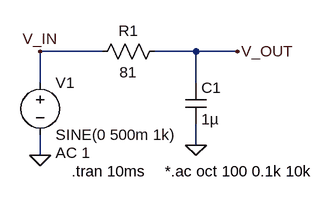
[diagram p0: schematic low_pass_filter.asc]
low_pass_filter.asc, the LTspice schematic file:
Version 4
SHEET 1 880 680
WIRE 144 112 48 112
WIRE 288 112 224 112
WIRE 352 112 288 112
WIRE 48 160 48 112
WIRE 288 160 288 112
WIRE 288 256 288 224
WIRE 48 272 48 240
FLAG 48 272 0
FLAG 288 256 0
FLAG 352 112 V_OUT
FLAG 48 112 V_IN
SYMBOL res 240 96 R90
WINDOW 0 0 56 VBottom 2
WINDOW 3 32 56 VTop 2
SYMATTR InstName R1
SYMATTR Value 81
SYMBOL cap 272 160 R0
SYMATTR InstName C1
SYMATTR Value 1µ
SYMBOL voltage 48 144 R0
WINDOW 123 24 124 Left 2
WINDOW 39 0 0 Left 0
SYMATTR InstName V1
SYMATTR Value SINE(0 500m 1k)
SYMATTR Value2 AC 1
TEXT 240 296 Left 2 !*.ac oct 100 0.1k 10k
TEXT 96 296 Left 2 !.tran 10ms

The netlist it stands for:
* low_pass_filter.asc
R1 V_OUT V_IN 81
C1 V_OUT 0 1µ
V1 V_IN 0 SINE(0 500m 1k) AC 1
*.ac oct 100 0.1k 10k
.tran 10ms
.backanno
.end